# Altium schematic sheet COMM.SchDoc
size A4; SheetNumber: 4; SheetTotal: 6
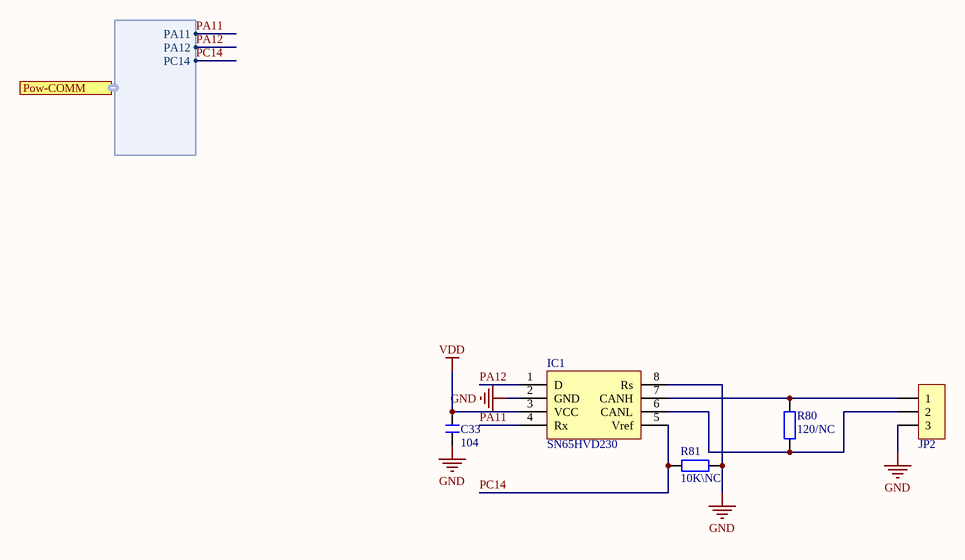
[diagram p0: COMM.SchDoc]

## Parts
C33  104  [C 0603_L]
IC1  SN65HVD230  [SOP8_N]
JP2  HDR-1X3  [XH2.54-WI-3P]  (value not drawn)
R80  120/NC  [R 1206_L]
R81  10K\NC  [R 0603_L]

## Ports
Pow-COMM (harness Pow-COMM, see TopLevel[2C], MCU[2A])

## Harnesses
Pow-COMM: PA11, PA12, PC14

## Nets
GND: C33.2 IC1.2(GND) IC1.8(Rs) JP2.3 R81.2
VDD: C33.1 IC1.3(VCC)
PA11: IC1.4(Rx) ; port Pow-COMM.PA11
PA12: IC1.1(D) ; port Pow-COMM.PA12
PC14: IC1.5(Vref) R81.1 ; port Pow-COMM.PC14
NetIC1_6: IC1.6(CANL) JP2.2 R80.1
NetIC1_7: IC1.7(CANH) JP2.1 R80.2

## Library data of the parts
C33 = C: 无极性贴片电容; 版权归属: 源创客; BOM名称: 无极性贴片电容; 学习资源: www.ooocke.com
IC1 = SN65HVD230: CAN芯片; 版权归属: 源创客; BOM名称: CAN芯片; 学习资源: www.ooocke.com
JP2 = Header 3: 3P接插件; 版权归属: 源创客; BOM名称: 3P接插件; 学习资源: www.ooocke.com
R80 R81 = R: 贴片电阻; 版权归属: 源创客; BOM名称: 贴片电阻; 学习资源: www.ooocke.com